# Altium schematic sheet Display.SchDoc: GSM
size A4; SheetNumber: 10; SheetTotal: 10
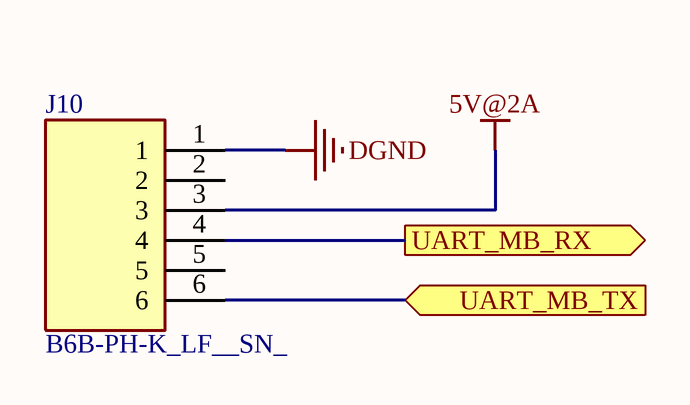
[diagram p0: Display.SchDoc]

## Parts
J10  B6B-PH-K_LF__SN_  [SHDR6W50P0X200_1X6_1390X450X600P]

## Ports
UART_MB_RX (out), UART_MB_TX (in)

## Nets
5V@2A: J10.3
DGND: J10.1
UART_MB_RX: J10.4 ; port UART_MB_RX
UART_MB_TX: J10.6 ; port UART_MB_TX

Not connected (* = marked no-connect by the designer): J10 2 5

## Notes on the sheet
- Title
- Size:
- Date:
- A3
- Author:
- Time:
- Revision:
- Sheet
- of
- File:

## Library data of the parts
J10 = B6B-PH-K_LF__SN_: Connector; Manufacturer_Name: JST (JAPAN SOLDERLESS TERMINALS); Manufacturer_Part_Number: B6B-PH-K(LF)(SN); Datasheet Link: https://www.jst-mfg.com/product/pdf/eng/ePH.pdf; Height: 6mm; Mouser Part Number: 306-B6BPHKLFSNP; Mouser Price/Stock: https://www.mouser.co.uk/ProductDetail/JST-Commercial/B6B-PH-KLFSN?qs=cdbOS8ANM9DNW35JVflPvg%3D%3D; LCSC_PN: C495261